# EAGLE design CIRCUIT SCHEMATIC (EAGLE 8.4.0)
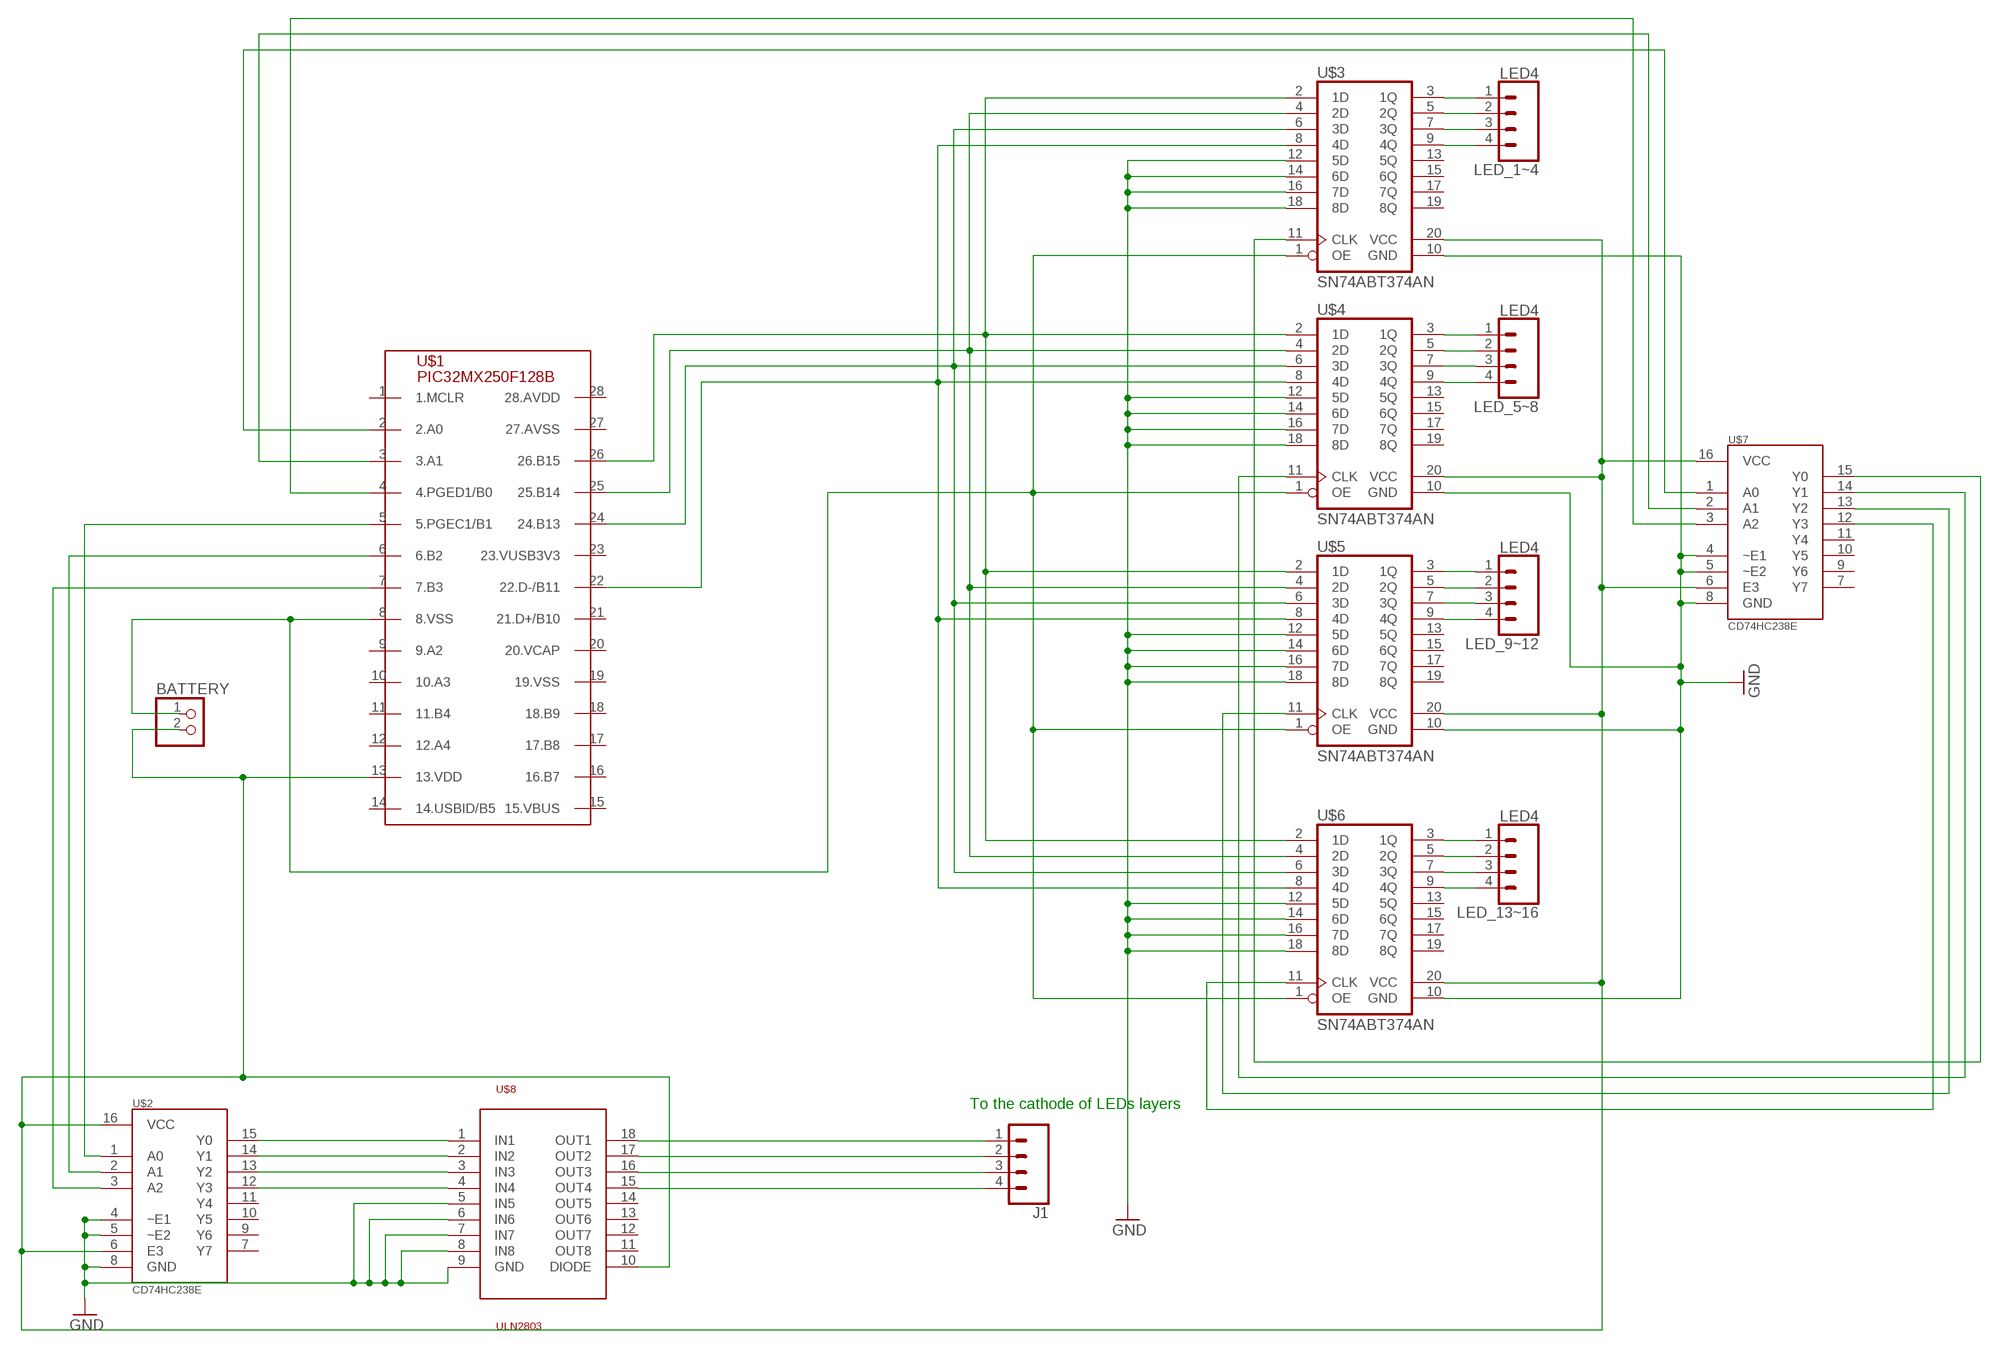
[diagram p0: schematic, sheet 1]

## Parts
BATTERY  PINHD-1X2  [1X02]
J1  CONN_04  [1X04]
LED_1~4  LED4  [1X04]
LED_5~8  LED4  [1X04]
LED_9~12  LED4  [1X04]
LED_13~16  LED4  [1X04]
U$1  PIC32MX250F128B  [DIL28-3]
U$2  CD74HC238E  [DIL16]
U$3  SN74ABT374AN  [DIL20]
U$4  SN74ABT374AN  [DIL20]
U$5  SN74ABT374AN  [DIL20]
U$6  SN74ABT374AN  [DIL20]
U$7  CD74HC238E  [DIL16]
U$8  ULN2803  [SO18L]

## Nets
DIODE: BATTERY.2 U$1.13(13.VDD) U$2.6(E3) U$2.16(VCC) U$3.20(VCC) U$4.20(VCC) U$5.20(VCC) U$6.20(VCC) U$7.6(E3) U$7.16(VCC) U$8.10(DIODE)
GND: U$2.4(~E1) U$2.5(~E2) U$2.8(GND) U$3.10(GND) U$3.12(5D) U$3.14(6D) U$3.16(7D) U$3.18(8D) U$4.10(GND) U$4.12(5D) U$4.14(6D) U$4.16(7D) U$4.18(8D) U$5.10(GND) U$5.12(5D) U$5.14(6D) U$5.16(7D) U$5.18(8D) U$6.10(GND) U$6.12(5D) U$6.14(6D) U$6.16(7D) U$6.18(8D) U$7.4(~E1) U$7.5(~E2) U$7.8(GND) U$8.5(IN5) U$8.6(IN6) U$8.7(IN7) U$8.8(IN8) U$8.9(GND)
LED1: LED_1~4.1 U$3.3(1Q)
N$1: U$2.15(Y0) U$8.1(IN1)
N$2: U$2.14(Y1) U$8.2(IN2)
N$3: U$2.13(Y2) U$8.3(IN3)
N$4: U$2.12(Y3) U$8.4(IN4)
N$9: J1.1 U$8.18(OUT1)
N$10: J1.2 U$8.17(OUT2)
N$11: J1.3 U$8.16(OUT3)
N$12: J1.4 U$8.15(OUT4)
N$17: U$1.5(5.PGEC1/B1) U$2.1(A0)
N$18: U$1.6(6.B2) U$2.2(A1)
N$19: U$1.7(7.B3) U$2.3(A2)
N$20: LED_9~12.1 U$5.3(1Q)
N$21: BATTERY.1 U$1.8(8.VSS) U$3.1(OE) U$4.1(OE) U$5.1(OE) U$6.1(OE)
N$22: U$1.26(26.B15) U$3.2(1D) U$4.2(1D) U$5.2(1D) U$6.2(1D)
N$23: U$1.25(25.B14) U$3.4(2D) U$4.4(2D) U$5.4(2D) U$6.4(2D)
N$24: U$1.22(22.D-/B11) U$3.8(4D) U$4.8(4D) U$5.8(4D) U$6.8(4D)
N$25: U$1.24(24.B13) U$3.6(3D) U$4.6(3D) U$5.6(3D) U$6.6(3D)
N$31: U$3.11(CLK) U$7.15(Y0)
N$32: U$4.11(CLK) U$7.14(Y1)
N$33: U$1.3(3.A1) U$7.2(A1)
N$34: U$1.4(4.PGED1/B0) U$7.3(A2)
N$35: U$5.11(CLK) U$7.13(Y2)
N$36: U$6.11(CLK) U$7.12(Y3)
N$38: LED_9~12.2 U$5.5(2Q)
N$39: U$1.2(2.A0) U$7.1(A0)
N$40: LED_1~4.2 U$3.5(2Q)
N$41: LED_1~4.3 U$3.7(3Q)
N$42: LED_1~4.4 U$3.9(4Q)
N$43: LED_9~12.3 U$5.7(3Q)
N$44: LED_9~12.4 U$5.9(4Q)
N$47: LED_5~8.1 U$4.3(1Q)
N$48: LED_5~8.2 U$4.5(2Q)
N$49: LED_5~8.3 U$4.7(3Q)
N$50: LED_5~8.4 U$4.9(4Q)
N$63: LED_13~16.1 U$6.3(1Q)
N$64: LED_13~16.2 U$6.5(2Q)
N$65: LED_13~16.3 U$6.7(3Q)
N$66: LED_13~16.4 U$6.9(4Q)
Unconnected: U$1.1(1.MCLR) U$1.9(9.A2) U$1.10(10.A3) U$1.11(11.B4) U$1.12(12.A4) U$1.14(14.USBID/B5) U$1.15(15.VBUS) U$1.16(16.B7) U$1.17(17.B8) U$1.18(18.B9) U$1.19(19.VSS) U$1.20(20.VCAP) U$1.21(21.D+/B10) U$1.23(23.VUSB3V3) U$1.27(27.AVSS) U$1.28(28.AVDD) U$2.7(Y7) U$2.9(Y6) U$2.10(Y5) U$2.11(Y4) U$3.13(5Q) U$3.15(6Q) U$3.17(7Q) U$3.19(8Q) U$4.13(5Q) U$4.15(6Q) U$4.17(7Q) U$4.19(8Q) U$5.13(5Q) U$5.15(6Q) U$5.17(7Q) U$5.19(8Q) U$6.13(5Q) U$6.15(6Q) U$6.17(7Q) U$6.19(8Q) U$7.7(Y7) U$7.9(Y6) U$7.10(Y5) U$7.11(Y4) U$8.11(OUT8) U$8.12(OUT7) U$8.13(OUT6) U$8.14(OUT5)

## Notes on the sheet
- To the cathode of LEDs layers

## Library data of the parts
BATTERY = pinhead:PINHD-1X2: PIN HEADER
J1 = SparkFun-Connectors:CONN_04: Multi connection point. Often used as Generic Header-pin footprint for 0.1 inch spaced/style header connections On any of the 0.1 inch spaced packages, you can populate with these: Break Away Headers - Straight <https://www.sparkfun.com/products/116> (PRT-00116) Break Away Male Headers - Right Angle <https://www.sparkfun.com/products/553> (PRT-00553) Female Headers <https://www.sparkfun.com/products/115> (PRT-00115) Break Away Headers - Machine Pin <https://www.sparkfun.com/products/117> (PRT-00117) Break Away Female Headers - Swiss Machine Pin <https://www.sparkfun.com/products/743> (PRT-00743) For SCREWTERMINALS and SPRING TERMINALS visit here: Screw Terimnals on SparkFun.com <https://www.sparkfun.com/search/results?term=Screw+Terminals> (5mm/3.5mm/2.54mm spacing) This device is also useful as a general connection point to wire up your design to another part of your project. Our various solder wires solder well into these plated through hole pads. Hook-Up Wire - Assortment (Stranded, 22 AWG) <https://www.sparkfun.com/products/11375> (PRT-11375) Hook-Up Wire - Assortment (Solid Core, 22 AWG) <https://www.sparkfun.com/products/11367> (PRT-11367) View the entire wire category on our website here <https://www.sparkfun.com/categories/141> Special notes: Molex polarized connector foot print use with SKU : PRT-08231 with associated crimp pins and housings. 1MM SMD Version SKU: PRT-10208; PROD_ID: CONN-09696
LED_1~4 LED_5~8 LED_9~12 LED_13~16 = ECE411:LED4
U$1 = ECE411:PIC32MX250F128B
U$2 U$7 = ECE411:CD74HC238E
U$3-U$6 = ECE411:SN74ABT374AN
U$8 = uln2803:ULN2803

## Net classes
0 default: width 0.305 mm, drill 0.508 mm, clearance 0.254 mm

## Board
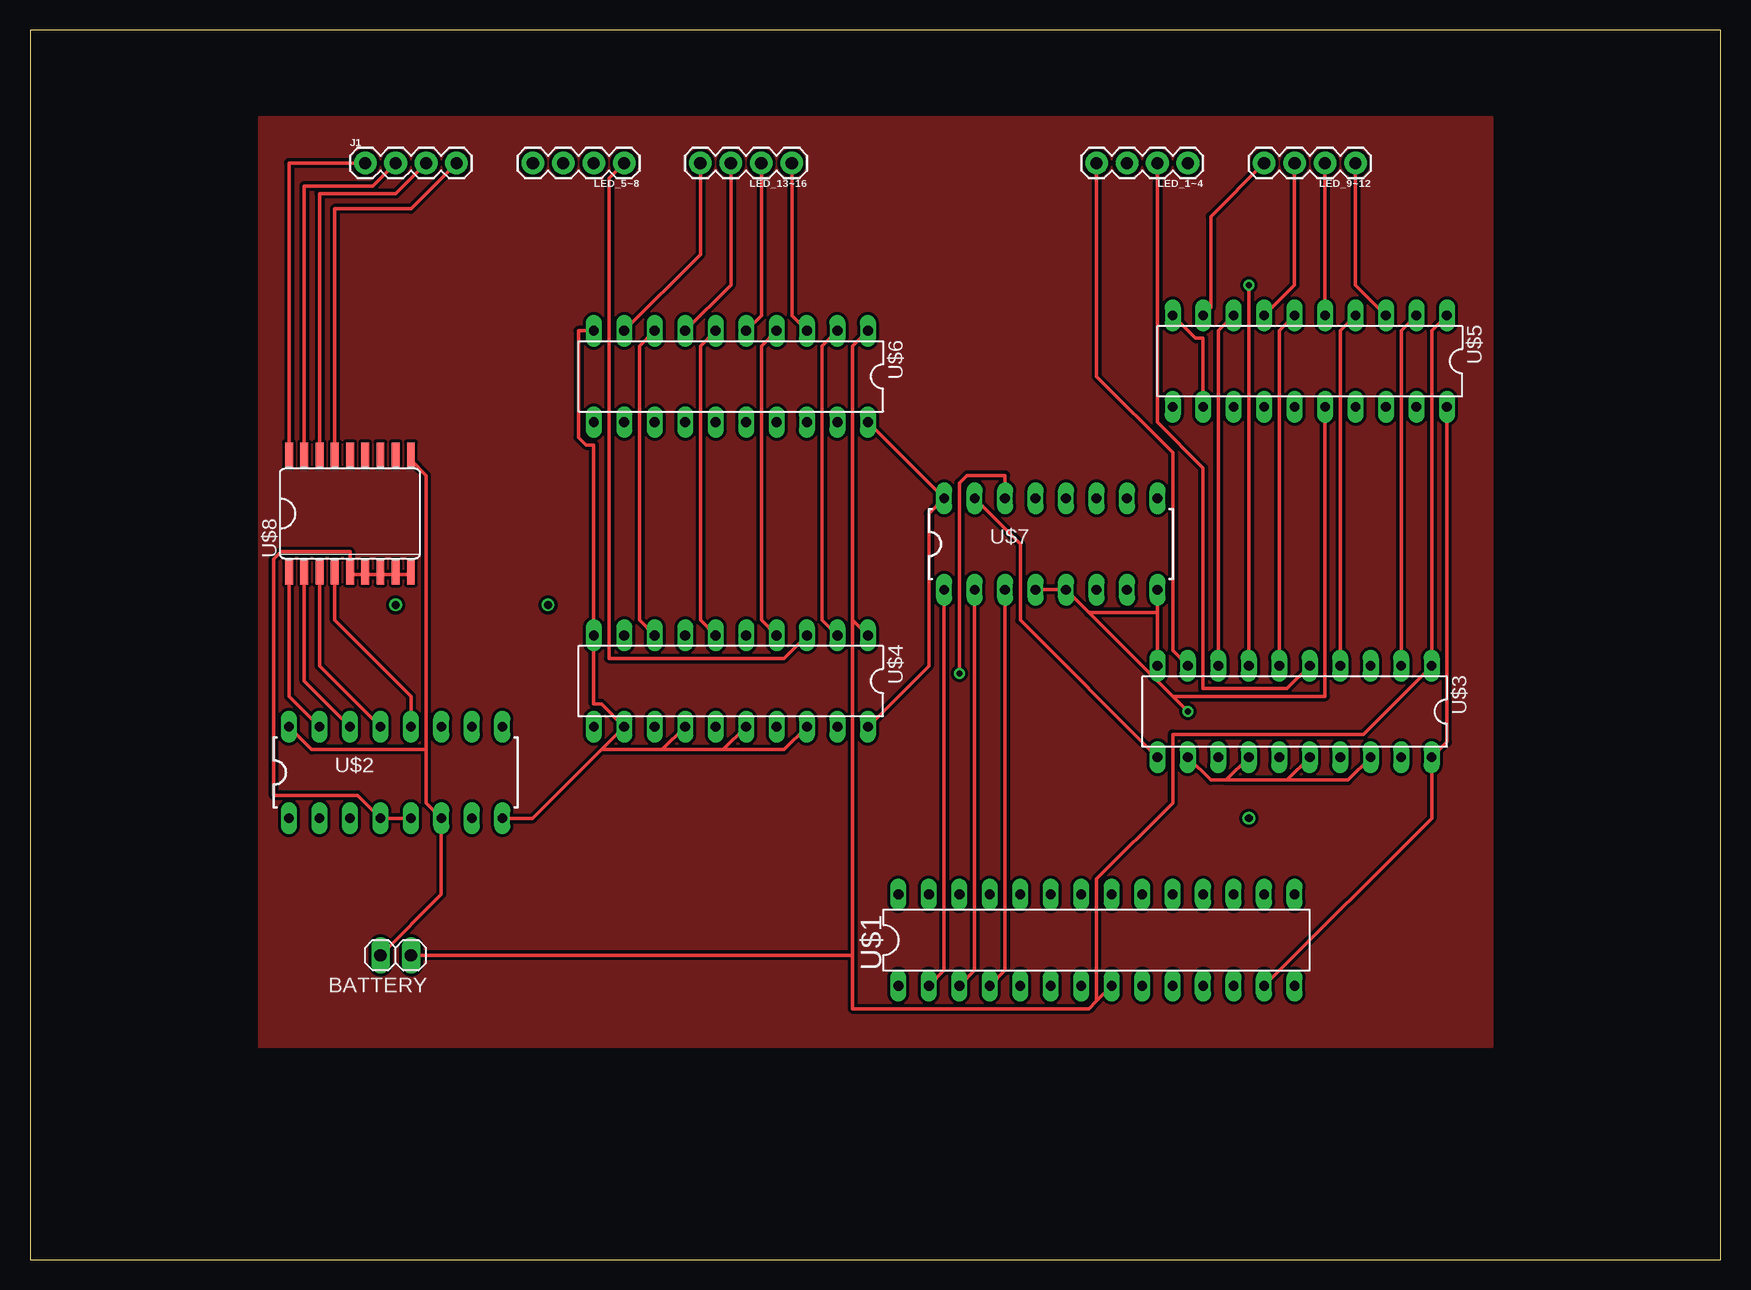
[diagram p1: board, top side]
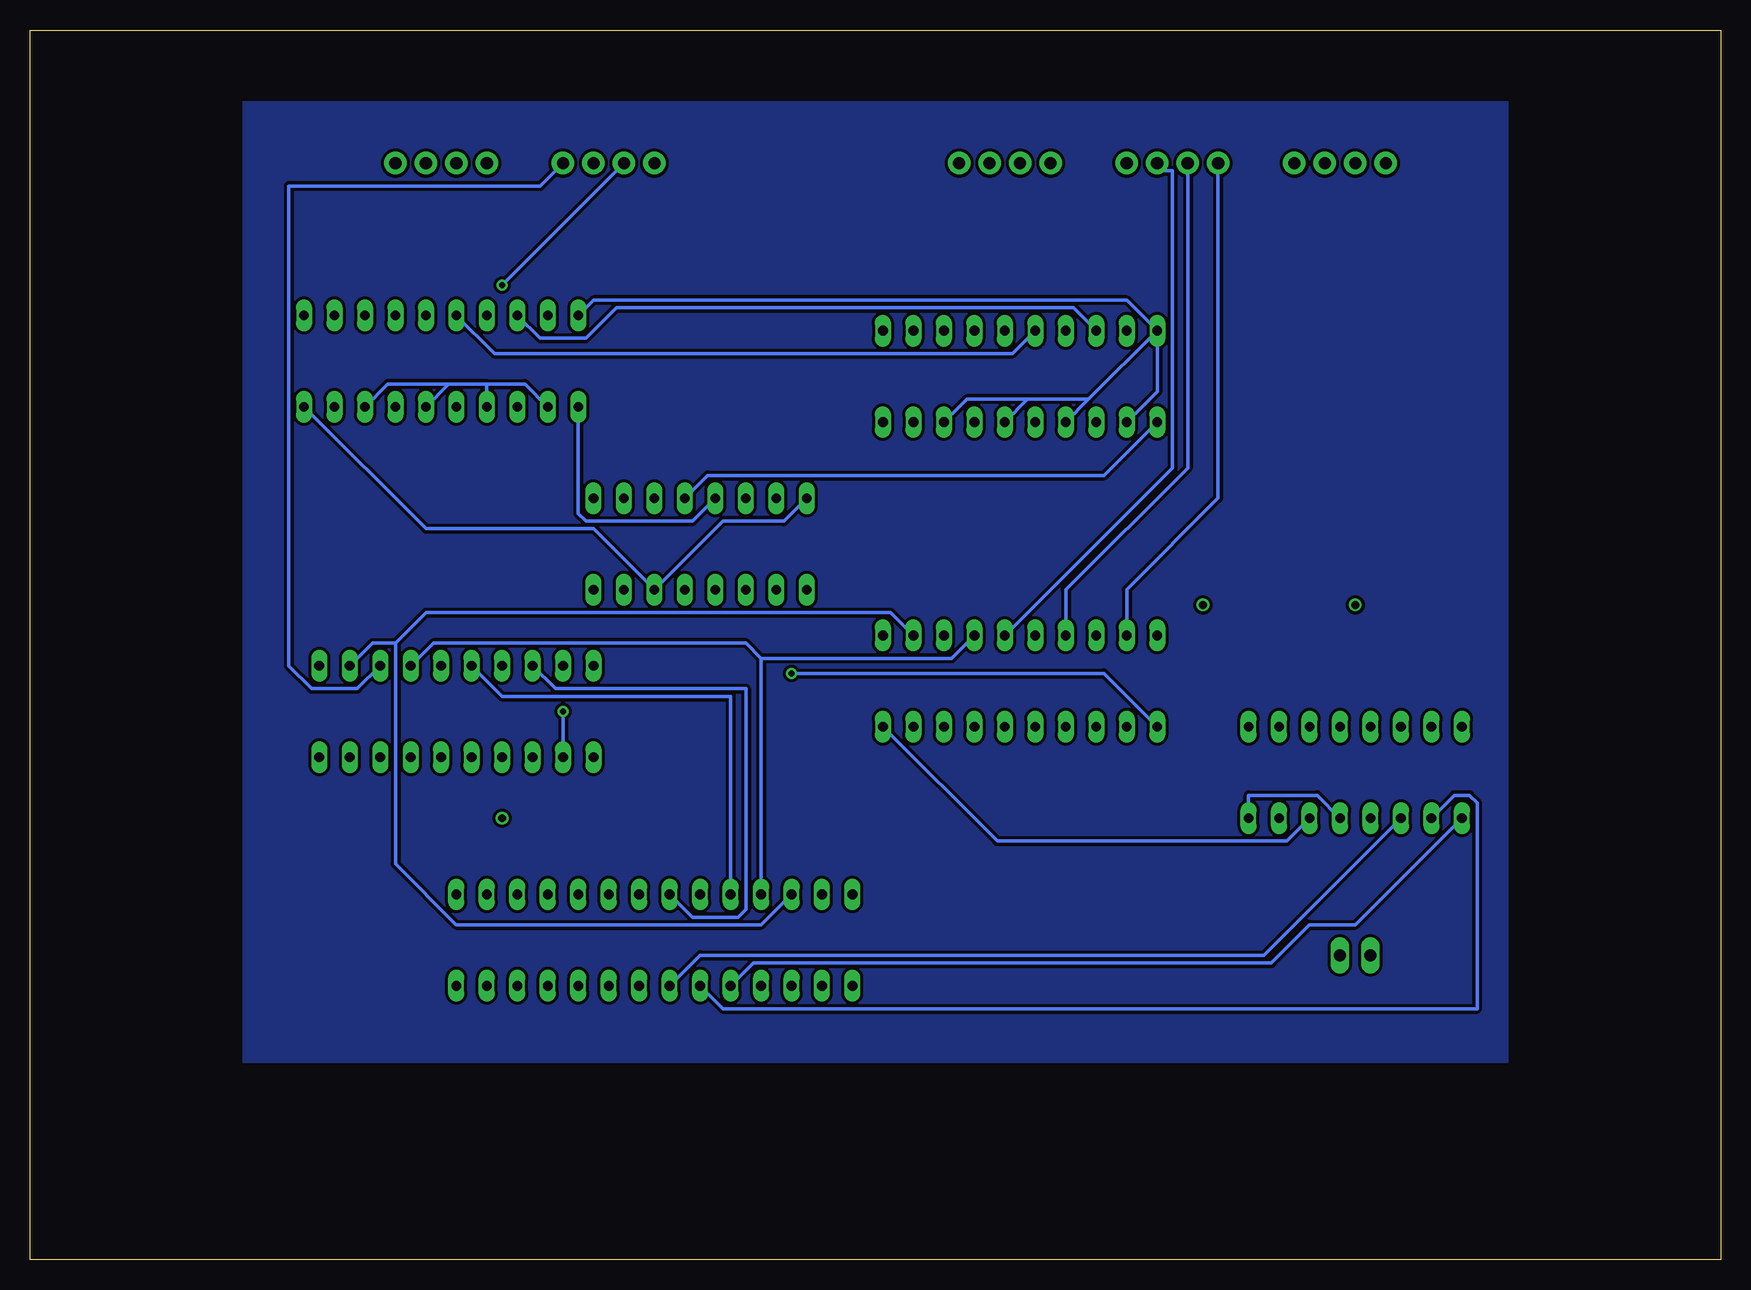
[diagram p2: board, bottom side, seen from below]

Size 140.95 x 102.54 mm. Coordinates in mm from the lower left corner, seen from the top.
Outline: 0,0 140.95,0 140.95,102.54 0,102.54 0,0
Copper layers (1*16): Top 0.035mm / dielectric 1.5mm / Bottom 0.035mm
Design rules "default": minimum track width 6mil, minimum drill 0.35mm, track to track 6mil, track to pad 6mil, pad to pad 6mil, via to via 6mil, smd to smd 6mil, copper to edge 40mil, drill to drill 6mil, minimum pad ring 10mil, minimum via ring 8mil, stop-mask expansion 4mil, vias tented up to drill 0mil, thermal gap 10mil

### Footprints (pad centres in the part's own frame; a part is rotated, then mirrored left to right if it is on the bottom)
1X02 = drill 1.016 long: 1 -1.27,0; 2 1.27,0
1X04 = drill 1.016 pad 1.88: 1 0,0; 2 2.54,0; 3 5.08,0; 4 7.62,0
DIL28-3 = drill 0.813 long: 1 -16.51,-3.81; 2 -13.97,-3.81; 3 -11.43,-3.81; 4 -8.89,-3.81; 5 -6.35,-3.81; 6 -3.81,-3.81; 7 -1.27,-3.81; 8 1.27,-3.81; 9 3.81,-3.81; 10 6.35,-3.81; 11 8.89,-3.81; 12 11.43,-3.81; 13 13.97,-3.81; 14 16.51,-3.81; 15 16.51,3.81; 16 13.97,3.81; 17 11.43,3.81; 18 8.89,3.81; 19 6.35,3.81; 20 3.81,3.81; 21 1.27,3.81; 22 -1.27,3.81; 23 -3.81,3.81; 24 -6.35,3.81; 25 -8.89,3.81; 26 -11.43,3.81; 27 -13.97,3.81; 28 -16.51,3.81
DIL16 = drill 0.813 long: 1 -8.89,-3.81; 2 -6.35,-3.81; 3 -3.81,-3.81; 4 -1.27,-3.81; 5 1.27,-3.81; 6 3.81,-3.81; 7 6.35,-3.81; 8 8.89,-3.81; 9 8.89,3.81; 10 6.35,3.81; 11 3.81,3.81; 12 1.27,3.81; 13 -1.27,3.81; 14 -3.81,3.81; 15 -6.35,3.81; 16 -8.89,3.81
DIL20 = drill 0.813 long: 1 -11.43,-3.81; 2 -8.89,-3.81; 3 -6.35,-3.81; 4 -3.81,-3.81; 5 -1.27,-3.81; 6 1.27,-3.81; 7 3.81,-3.81; 8 6.35,-3.81; 9 8.89,-3.81; 10 11.43,-3.81; 11 11.43,3.81; 12 8.89,3.81; 13 6.35,3.81; 14 3.81,3.81; 15 1.27,3.81; 16 -1.27,3.81; 17 -3.81,3.81; 18 -6.35,3.81; 19 -8.89,3.81; 20 -11.43,3.81
SO18L = smd 0.66 x 2.032: 1 -5.08,-4.902; 2 -3.81,-4.902; 3 -2.54,-4.902; 4 -1.27,-4.902; 5 0,-4.902; 6 1.27,-4.902; 7 2.54,-4.902; 8 3.81,-4.902; 9 5.08,-4.902; 10 5.08,4.902; 11 3.81,4.902; 12 2.54,4.902; 13 1.27,4.902; 14 0,4.902; 15 -1.27,4.902; 16 -2.54,4.902; 17 -3.81,4.902; 18 -5.08,4.902

### Placement (x,y rotation side)
BATTERY  30.48,25.4 180 top
J1  27.94,91.44 0 top
LED_1~4  96.52,91.44 180 top
LED_5~8  49.53,91.44 180 top
LED_9~12  110.49,91.44 180 top
LED_13~16  63.5,91.44 180 top
U$1  88.9,26.67 0 top
U$2  30.48,40.64 0 top
U$3  105.41,45.72 180 top
U$4  58.42,48.26 180 top
U$5  106.68,74.93 180 top
U$6  58.42,73.66 180 top
U$7  85.09,59.69 0 top
U$8  26.67,62.23 0 top

### Tracks (layer width: path | path; a pad name or v marks a point on that pad's centre or on a via)
DIODE
  Top 0.305: 33.02,42.55 33.02,38.1 U$2.6 34.29,30.48 BATTERY.2 | 33.02,42.55 33.02,65.41 31.75,66.67 U$8.10 | U$2.16 23.5,42.55 33.02,42.55 | U$4.20 74.93,49.53 74.93,62.23 U$7.16 U$6.20 | U$1.13 116.84,36.83 U$3.20 118.11,43.18 U$5.20
  Bottom 0.305: U$7.16 78.11,61.59 83.19,61.59 U$7.6 93.98,60.96 107.95,60.96 U$5.20 | U$2.6 36.2,34.92 60.33,34.92 U$4.20
GND  (via drill 0.51)
  Top 0.305: U$7.4 U$7.5 88.27,53.98 | U$7.8 93.98,53.98 | 93.98,53.98 U$3.10 | 93.98,53.98 88.27,53.98 | U$2.5 U$2.4 27.31,38.73 20.32,38.73 20.32,58.42 20.96,59.05 26.67,59.05 U$8.5 26.67,57.15 27.94,57.15 | U$3.12 98.43,40 99.7,40 | U$3.14 99.7,40 | 104.78,40 U$3.16 | 99.7,40 104.78,40 | U$3.18 109.86,40 104.78,40 | 47.62,42.55 41.91,36.83 U$2.8 | 47.62,42.55 U$4.12 47.62,46.36 46.99,46.36 U$4.10 46.99,67.94 46.36,67.94 45.72,68.58 45.72,77.47 U$6.10 | 52.7,42.55 U$4.14 | 47.62,42.55 52.7,42.55 | 57.79,42.55 U$4.16 | 52.7,42.55 57.79,42.55 | U$4.18 62.87,42.55 57.79,42.55 | 88.27,53.98 95.25,46.99 | 95.25,46.99 v96.52,45.72 | U$5.12 97.79,76.83 97.16,76.83 U$5.10 | U$5.16 107.95,46.99 95.25,46.99 | 27.94,57.15 29.21,57.15 | 27.94,57.15 U$8.6 | 29.21,57.15 30.48,57.15 | 29.21,57.15 U$8.7 | 30.48,57.15 31.75,57.15 U$8.9 | 30.48,57.15 U$8.8
  Bottom 0.305: U$5.10 93.98,80.01 49.53,80.01 U$6.10 | U$5.12 99.7,73.03 102.87,73.03 | U$5.14 102.87,73.03 | 106.05,73.03 U$5.16 | 102.87,73.03 106.05,73.03 | U$5.18 111.12,73.03 106.05,73.03 | U$6.12 46.99,72.39 U$6.10 | U$6.10 52.7,71.75 | 52.7,71.75 U$6.14 | 57.79,71.75 U$6.16 | 52.7,71.75 57.79,71.75 | U$6.18 62.87,71.75 57.79,71.75 | v96.52,45.72 U$3.12 | U$2.5 33.66,38.73 39.37,38.73 U$2.8
LED1
  Bottom 0.305: U$3.3 113.66,47.62 117.47,47.62 119.38,49.53 119.38,89.53 98.43,89.53 LED_1~4.1
N$1
  Top 0.305: U$8.1 21.59,46.99 U$2.15
N$2
  Top 0.305: U$8.2 22.86,48.26 U$2.14
N$3
  Top 0.305: U$8.3 24.13,49.53 U$2.13
N$4
  Top 0.305: U$8.4 25.4,53.34 31.75,46.99 U$2.12
N$5
  pour Top: 19.05,95.25 19.05,17.78 121.92,17.78 121.92,95.25
N$6
  pour Bottom: 17.78,95.25 17.78,96.52 123.19,96.52 123.19,16.51 17.78,16.51
N$7  (via drill 0.65)
  other vias: 30.48,54.61
N$8  (via drill 0.65)
  other vias: 43.18,54.61
N$9
  Top 0.305: U$8.18 21.59,91.44 J1.1
N$10
  Top 0.305: U$8.17 22.86,89.53 28.57,89.53 J1.2
N$11
  Top 0.305: U$8.16 24.13,88.9 30.48,88.9 J1.3
N$12
  Top 0.305: U$8.15 25.4,87.63 31.75,87.63 J1.4
N$13  (via drill 0.65)
  other vias: 101.6,36.83
N$17
  Bottom 0.305: U$2.1 30.48,27.94 34.29,27.94 37.47,24.77 80.65,24.77 U$1.5
N$18
  Bottom 0.305: U$2.2 22.22,38.73 20.96,38.73 20.32,38.1 20.32,20.95 83.19,20.95 U$1.6
N$19
  Bottom 0.305: U$2.3 38.1,25.4 85.09,25.4 U$1.7
N$20
  Top 0.305: U$5.3 110.49,81.28 LED_9~12.1
N$21
  Top 0.305: U$5.1 116.84,77.47 U$3.1 111.12,43.81 95.25,43.81 95.25,38.1 88.9,31.75 88.9,21.59 | 68.58,53.34 U$4.1 | 68.58,53.34 68.58,76.2 U$6.1 | 88.9,21.59 88.27,20.95 68.58,20.95 68.58,25.4 | 88.9,21.59 U$1.8 | 68.58,53.34 68.58,25.4 | 68.58,25.4 BATTERY.1
N$22
  Top 0.305: U$4.2 66.04,53.34 66.04,76.2 U$6.2 | U$5.2 114.3,77.47 U$3.2
  Bottom 0.305: U$1.26 80.01,27.94 105.41,27.94 110.49,33.02 110.49,51.44 | 110.49,51.44 112.4,51.44 U$3.2 | U$4.2 69.22,53.98 107.95,53.98 110.49,51.44
N$23
  Top 0.305: U$3.4 109.22,77.47 U$5.4 | U$6.4 60.96,76.2 60.96,53.34 U$4.4
  Bottom 0.305: 80.01,50.16 U$1.25 | 80.01,50.16 64.14,50.16 U$4.4 | U$3.4 107.31,51.44 81.28,51.44 80.01,50.16
N$24
  Top 0.305: U$4.8 50.8,53.34 50.8,76.2 U$6.8 | U$5.8 99.06,77.47 U$3.8
  Bottom 0.305: U$1.22 85.73,28.57 81.92,28.57 81.28,29.21 81.28,47.62 97.16,47.62 U$3.8 | U$6.8 53.98,79.38 92.08,79.38 94.62,76.83 98.43,76.83 U$5.8
N$25
  Top 0.305: U$4.6 55.88,53.34 55.88,76.2 U$6.6 | U$5.6 104.14,77.47 U$3.6
  Bottom 0.305: U$1.24 82.55,46.99 101.6,46.99 U$3.6 | U$6.6 59.06,75.56 102.23,75.56 U$5.6
N$31
  Top 0.305: U$3.11 82.55,53.34 82.55,59.69 U$7.15
N$32  (via drill 0.51)
  Top 0.305: v77.47,48.9 77.47,64.77 78.11,65.41 81.28,65.41 U$7.14
  Bottom 0.305: U$4.11 51.44,48.9 v77.47,48.9
N$33
  Top 0.305: U$1.3 78.74,24.13 U$7.2
N$34
  Top 0.305: U$1.4 81.28,24.13 U$7.3
N$35
  Bottom 0.305: U$7.13 85.73,61.59 94.62,61.59 95.25,62.23 U$5.11
N$36
  Bottom 0.305: U$6.11 51.44,65.41 84.45,65.41 U$7.12
N$38
  Top 0.305: LED_9~12.2 U$5.5
N$39
  Top 0.305: U$1.2 76.2,24.13 U$7.1
N$40
  Top 0.305: U$3.5 104.78,47.62 97.79,47.62 97.79,66.04 93.98,69.85 LED_1~4.2
N$41  (via drill 0.51)
  Top 0.305: v101.6,81.28 U$3.7
  Bottom 0.305: LED_1~4.3 v101.6,81.28
N$42
  Top 0.305: U$3.9 95.25,50.8 95.25,67.31 88.9,73.66 LED_1~4.4
N$43
  Top 0.305: U$5.7 105.41,81.28 LED_9~12.3
N$44
  Top 0.305: U$5.9 98.43,79.38 98.43,87 LED_9~12.4
N$47
  Top 0.305: U$4.3 62.87,50.16 48.26,50.16 48.26,90.17 LED_5~8.1
N$48
  Bottom 0.305: U$4.5 45.72,66.04 45.72,90.81 46.36,90.81 LED_5~8.2
N$49
  Bottom 0.305: U$4.7 54.61,55.88 44.45,66.04 LED_5~8.3
N$50
  Bottom 0.305: U$4.9 49.53,55.88 41.91,63.5 LED_5~8.4
N$63
  Top 0.305: U$6.3 63.5,78.74 LED_13~16.1
N$64
  Top 0.305: U$6.5 60.96,78.74 LED_13~16.2
N$65
  Top 0.305: U$6.7 58.42,81.28 LED_13~16.3
N$66
  Top 0.305: U$6.9 55.88,83.82 LED_13~16.4